# Altium project MainBoard.PrjPCB
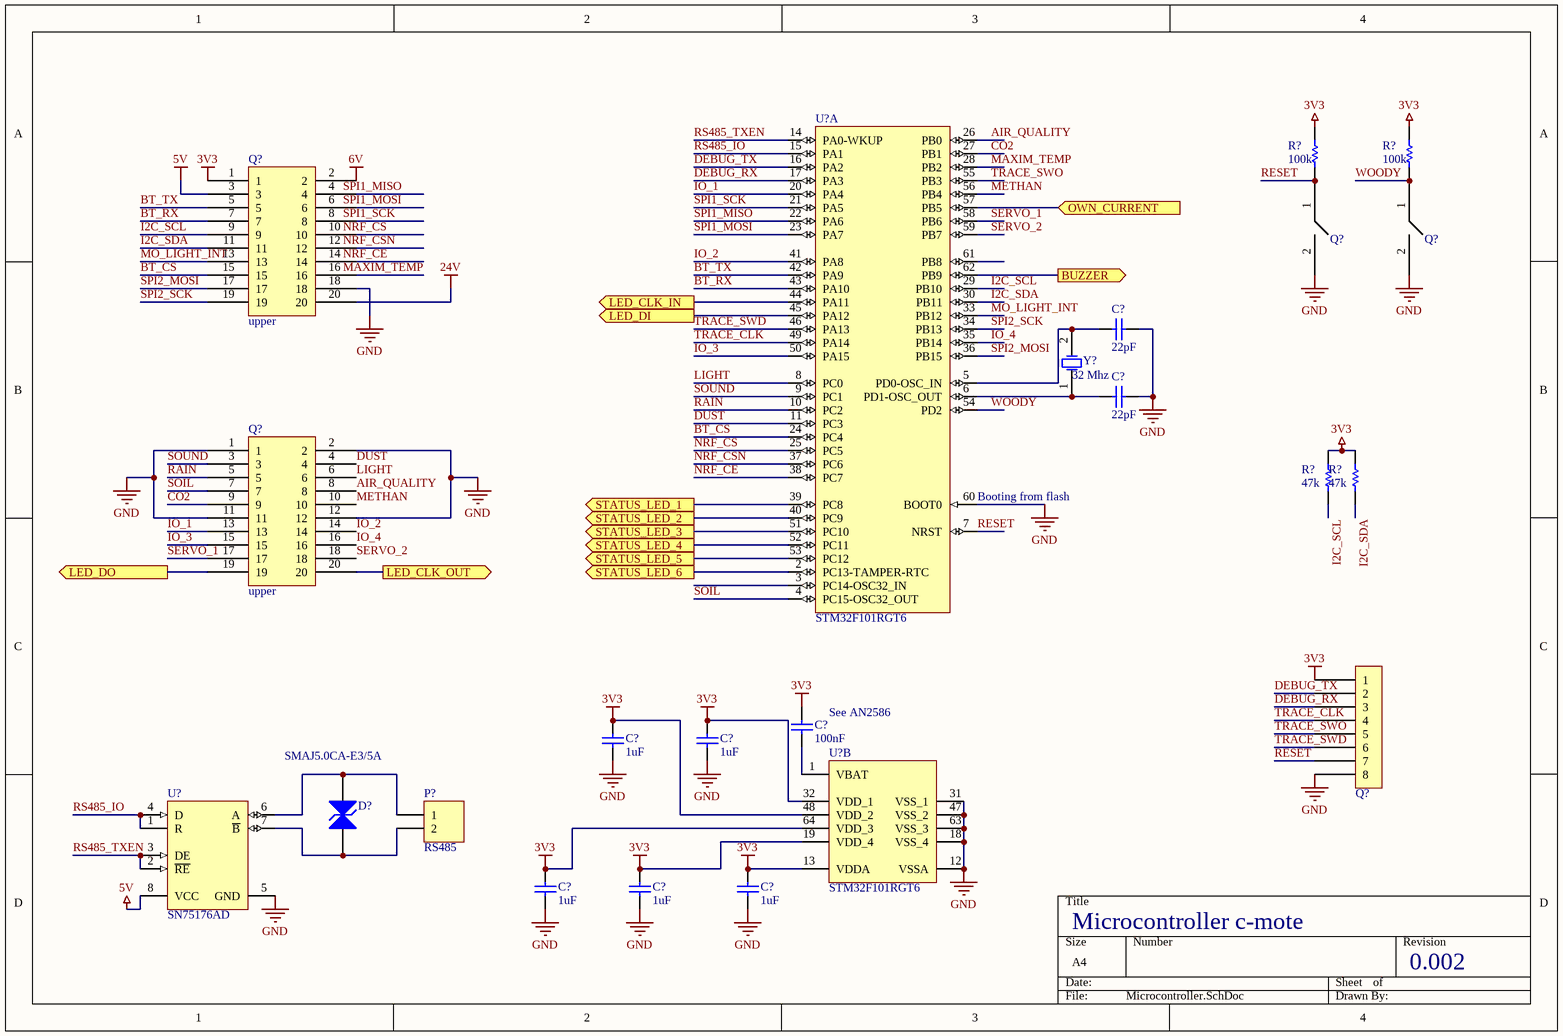
[diagram p0: Microcontroller.SchDoc]
3 sheets, 100 parts. Net scope: flat (ports and power ports of the same name join across sheets).
Sheets:
  Microcontroller.SchDoc
  Power.SchDoc
  IO.SchDoc

## Sheet Microcontroller.SchDoc
size A4

### Parts
(Parts that share a designator on the sheet are numbered #1, #2 ... from top to bottom, then left to right.)
C?#1  value 22pF  [CAPC0805(2012)100_M]  (hidden comment: CAP 22pF 10V 0805(2012))
C?#2  value 22pF  [CAPC0805(2012)100_M]  (hidden comment: CAP 22pF 10V 0805(2012))
C?#3  value 100nF  [CAPC0805(2012)100_M]  (hidden comment: CAP 22pF 10V 0805(2012))
C?#4  value 1uF  [CAPC0805(2012)100_M]  (hidden comment: CAP 22pF 10V 0805(2012))
C?#5  value 1uF  [CAPC0805(2012)100_M]  (hidden comment: CAP 22pF 10V 0805(2012))
C?#6  value 1uF  [CAPC0805(2012)100_M]  (hidden comment: CAP 22pF 10V 0805(2012))
C?#7  value 1uF  [CAPC0805(2012)100_M]  (hidden comment: CAP 22pF 10V 0805(2012))
C?#8  value 1uF  [CAPC0805(2012)100_M]  (hidden comment: CAP 22pF 10V 0805(2012))
D?#1  SMAJ5.0CA-E3/5A  [VISH-DO-214AC-2_N]
P?#1  RS485  [HDR1X2]
Q?#1  SMD Button  [SMD Button Right Angel]  (value not drawn)
Q?#2  SMD Button  [SMD Button Right Angel]  (value not drawn)
Q?#3  upper  [HEADER_2x10_SMD_1.27mm_TOP]
Q?#4  upper  [HEADER_2x10_SMD_1.27mm_TOP]
Q?#5  Program and debug interface  [Program and debug]  (value not drawn)
R?#1  100k  [RESC0805(2012)_L]
R?#2  100k  [RESC0805(2012)_L]
R?#3  47k  [RESC0805(2012)_L]
R?#4  47k  [RESC0805(2012)_L]
U?#1  STM32F101RGT6  [STM-LQFP64_V]  (part A of 2)
U?#2  STM32F101RGT6  [STM-LQFP64_V]  (part B of 2)
U?#3  SN75176AD  [D8_M]
Y?  32 Mhz  [R38]

### Ports
BUZZER (out), LED_CLK_IN (out), LED_CLK_OUT (out), LED_DI (out), LED_DO (out), OWN_CURRENT (in), STATUS_LED_1 (out), STATUS_LED_2 (out), STATUS_LED_3 (out), STATUS_LED_4 (out), STATUS_LED_5 (out), STATUS_LED_6 (out)

### Nets
3V3: C?#3.1 C?#4.2 C?#5.2 C?#6.2 C?#7.2 C?#8.2 Q?#3.1 Q?#5.1 R?#1.2 R?#2.2 R?#3.1 R?#4.1 U?#2.13(VDDA) U?#2.19(VDD_4) U?#2.32(VDD_1) U?#2.48(VDD_2) U?#2.64(VDD_3)
5V: Q?#3.3 U?#3.8(VCC)
6V: Q?#3.2
24V: Q?#3.20
GND: C?#1.1 C?#2.1 C?#4.1 C?#5.1 C?#6.1 C?#7.1 C?#8.1 Q?#1.2 Q?#2.2 Q?#3.18 Q?#4.1 Q?#4.2 Q?#4.11 Q?#4.12 Q?#5.8 U?#1.60(BOOT0) U?#2.12(VSSA) U?#2.18(VSS_4) U?#2.31(VSS_1) U?#2.47(VSS_2) U?#2.63(VSS_3) U?#3.5(GND)
AIR_QUALITY: Q?#4.8 U?#1.26(PB0)
BT_CS: Q?#3.15 U?#1.24(PC4)
BT_RX: Q?#3.7 U?#1.43(PA10)
BT_TX: Q?#3.5 U?#1.42(PA9)
CO2: Q?#4.9 U?#1.27(PB1)
DEBUG_RX: Q?#5.3 U?#1.17(PA3)
DEBUG_TX: Q?#5.2 U?#1.16(PA2)
DUST: Q?#4.4 U?#1.11(PC3)
I2C_SCL: Q?#3.9 R?#3.2 U?#1.29(PB10)
I2C_SDA: Q?#3.11 R?#4.2 U?#1.30(PB11)
IO_1: Q?#4.13 U?#1.20(PA4)
IO_2: Q?#4.14 U?#1.41(PA8)
IO_3: Q?#4.15 U?#1.50(PA15)
IO_4: Q?#4.16 U?#1.35(PB14)
LIGHT: Q?#4.6 U?#1.8(PC0)
MAXIM_TEMP: U?#1.28(PB2)
METHAN: Q?#4.10 U?#1.56(PB4)
MO_LIGHT_INT: Q?#3.13 U?#1.33(PB12)
NRF_CE: U?#1.38(PC7)
NRF_CS: U?#1.25(PC5)
NRF_CSN: U?#1.37(PC6)
RAIN: Q?#4.5 U?#1.10(PC2)
RESET: Q?#1.1 Q?#5.7 R?#1.1 U?#1.7(NRST)
RS485_IO: U?#1.15(PA1) U?#3.1(R) U?#3.4(D)
RS485_TXEN: U?#1.14(PA0-WKUP) U?#3.2(~{RE}) U?#3.3(DE)
SERVO_1: Q?#4.17 U?#1.58(PB6)
SERVO_2: Q?#4.18 U?#1.59(PB7)
SOIL: Q?#4.7 U?#1.4(PC15-OSC32_OUT)
SOUND: Q?#4.3 U?#1.9(PC1)
SPI1_MISO: U?#1.22(PA6)
SPI1_MOSI: U?#1.23(PA7)
SPI1_SCK: U?#1.21(PA5)
SPI2_MOSI: Q?#3.17 U?#1.36(PB15)
SPI2_SCK: Q?#3.19 U?#1.34(PB13)
TRACE_CLK: Q?#5.4 U?#1.49(PA14)
TRACE_SWD: Q?#5.6 U?#1.46(PA13)
TRACE_SWO: Q?#5.5 U?#1.55(PB3)
WOODY: Q?#2.1 R?#2.1 U?#1.54(PD2)
NetC?#1_2: C?#1.2 U?#1.5(PD0-OSC_IN) Y?.2(OSC2)
NetC?#2_2: C?#2.2 U?#1.6(PD1-OSC_OUT) Y?.1(OSC1)
NetC?#3_2: C?#3.2 U?#2.1(VBAT)
NetD?#1_1: D?#1.1(A1) P?#1.2 U?#3.7(~{B})
NetD?#1_2: D?#1.2(A2) P?#1.1 U?#3.6(A)
NetQ?#4_19: Q?#4.19 ; port LED_DO
NetQ?#4_20: Q?#4.20 ; port LED_CLK_OUT
NetQ?#9_11: U?#1.44(PA11) ; port LED_CLK_IN
NetQ?#9_13: U?#1.45(PA12) ; port LED_DI
NetQ?#10_1: U?#1.62(PB9) ; port BUZZER
NetR?#15_2: U?#1.57(PB5) ; port OWN_CURRENT
NetR?#18_2: U?#1.39(PC8) ; port STATUS_LED_1
NetR?#19_2: U?#1.40(PC9) ; port STATUS_LED_2
NetR?#20_2: U?#1.51(PC10) ; port STATUS_LED_3
NetR?#21_2: U?#1.52(PC11) ; port STATUS_LED_4
NetR?#25_2: U?#1.53(PC12) ; port STATUS_LED_5
NetR?#26_2: U?#1.2(PC13-TAMPER-RTC) ; port STATUS_LED_6

Not connected (* = marked no-connect by the designer): Q?#3 4 6 8 10 12 14 16; U?#1 3(PC14-OSC32_IN) 61(PB8)

### Notes on the sheet
- (near U?#1) Booting from flash
- (near C?#3) See AN2586
- Microcontroller c-mote
- 0.002
- Labels drawn without touching a wire or pin: MAXIM_TEMP, NRF_CE, NRF_CS, NRF_CSN, SPI1_MISO, SPI1_MOSI, SPI1_SCK

### Library data of the parts
C?#1-C?#8 = CMP-1036-01210-1: CAP 22pF 10V ±5% 0805 (2012 Metric) Thickness 1mm SMD; Case-EIA: 0805; Case-Metric: 2012; Max Thickness: 1 mm; Rated Voltage: 10 V; Tolerance: ±5%; Technology: SMT
D?#1 = CMP-0548-00276-2: Transient Voltage Suppressor, 6.40 to 231 V, 5 V Stand-off Voltage, Bi-Directional, -55 to 155 degC, 2-pin DO-214AC, Pb-Free, Tape and Reel; Manufacturer: Vishay Semiconductor; PPPM (W): 400, 300; VBR Bi-Directional (V): 6.4 to 231; ID (uA): 1600; IFSM: 40 A; VWM (V): 5; RoHS: TRUE; Operating Junction and Storage Temperature Range: -55 to 150 degC; Packing: Tape and Reel; ComponentLink1URL: http://www.vishay.com/; Mounting Technology: Surface Mount; ComponentLink2URL: http://www.vishay.com/docs/88390/smaj50a.pdf; PartNumber: SMAJ5.0CA-E3/5A; PackageReference: DO-214AC-2; ComponentLink1Description: Manufacturer URL; ComponentLink3Description: Package Specification; ComponentLink2Description: Datasheet; PackageDescription: 2-Pin DO-214AC (SMA), Body 4.245 x 2.665 mm; DatasheetVersion: 12/8/2013; ComponentLink3URL: http://www.vishay.com/docs/88390/smaj50a.pdf; digikey: http://www.digikey.com/product-detail/en/SMAJ5.0CA-E3%2F61/SMAJ5.0CA-E3%2F61GICT-ND/1091642
P?#1 = Header 2: Header, 2-Pin; LatestRevisionDate: 17-Jul-2002; LatestRevisionNote: Re-released for DXP Platform.; Publisher: Altium Limited
Q?#3 Q?#4 = c-moteconnector upper: c-mote upper connector
R?#1 R?#2 = CMP-1013-00122-1: 100K 0.125W 5% 0805 (2012 Metric)  SMD; Case-Metric: 2012; Case-EIA: 0805; Tolerance: 5 %; Technology: SMT; Value: 100k; Power: 0.125 W
R?#3 R?#4 = CMP-1013-00114-1: 47K 0.125W 5% 0805 (2012 Metric)  SMD; Case-Metric: 2012; Case-EIA: 0805; Tolerance: 5 %; Power: 0.125 W; Technology: SMT; Value: 47k
U?#1 U?#2 = CMP-0237-00281-2: ARM Cortex-M3 32-bit MCU, 1024 KB Flash, 80 KB Internal RAM, 51 I/Os, 64-pin LQFP, -40 to 85 degC, Tray; Internal RAM Size (kB): 80; FLASH Size (Prog) (kB): 1024; I/Os (High Current): 51; A/D Converter: 2x12-bit (16 Channels); D/A Converter: 2x12-bit (2 Channels); Supply Voltage(Vcc) min (V): 2; Operating Frequency(F) (Processor speed) (MHz): 36; ComponentLink2URL: http://www.st.com/st-web-ui/static/active/en/resource/technical/document/datasheet/CD00253739.pdf; Packing: Tray; PartNumber: STM32F101RGT6; ComponentLink3Description: Package Specification; PackageDescription: 64-Pin Low Profile Quad Flat Package, 10 x 10 mm Body, 0.5 mm Pitch; ComponentLink2Description: Datasheet; PackageReference: LQFP64; ComponentLink1URL: http://www.st.com/web/en/home.html; Core: ARM Cortex-M3; Mounting Technology: Surface Mount; PackageVersion: Rev. 4, 06/2013; ComponentLink1Description: Manufacturer URL; ComponentLink3URL: http://www.st.com/st-web-ui/static/active/en/resource/technical/document/datasheet/DM00037051.pdf; DatasheetVersion: Rev. 2
U?#3 = CMP-0310-00139-1: Differential Bus Transceiver, 1 TX / 1 RX, 5V, 0 to 70 degC, 8-Pin SOIC (D), Green (RoHS & no Sb/Br); Manufacturer: Texas Instruments; Drivers Per Package: 1; Rating: Catalog; Supply Voltage(s)(V): 5; ESD(kV): 2; ICC(Max)(mA): 50; SubFamily: RS-422; Mounting Technology: Surface Mount; Code_JEDEC: MS-012AA; PartNumber: SN75176AD; PackageVersion: revM, Jun-2011; PackageReference: D8; Eco-Plan: Green (RoHS & no Sb/Br); Receivers Per Package: 1; ComponentLink1URL: http://www.ti.com/general/docs/lit/getliterature.tsp?genericPartNumber=SN75176A&fileType=pdf; ComponentLink2Description: Package Specification; PackageDescription: 8-Pin Plastic Small Outline Integrated Circuit, 4.9 x 3.9 mm, Pitch 1.27 mm Pitch; ComponentLink2URL: http://www.ti.com/lit/ml/msoi002j/msoi002j.pdf; ComponentLink1Description: Datasheet; DatasheetVersion: SLLS100A; # of TX/RX: 1 TX / 1 RX; Isolated: No; Footprint: SN75176
Y? = XTAL: Crystal Oscillator; Published: 8-Jun-2000; LatestRevisionDate: 17-Jul-2002; LatestRevisionNote: Re-released for DXP Platform.; PackageReference: R38; Publisher: Altium Limited; PackageDescription: Crystal, Thru-Hole; 2 Leads; Body 3.1 x 8.2 mm (Dia.xH); Frequency: 32 Mhz
Q?#1 Q?#2 = SMD Button: AlieX: http://www.aliexpress.com/item/Original-new-100-100pcs-Little-turtle-button-switch-2-pin-SMD-tact-switch-with-fixed-point/1969145919.html

## Sheet Power.SchDoc
size A4
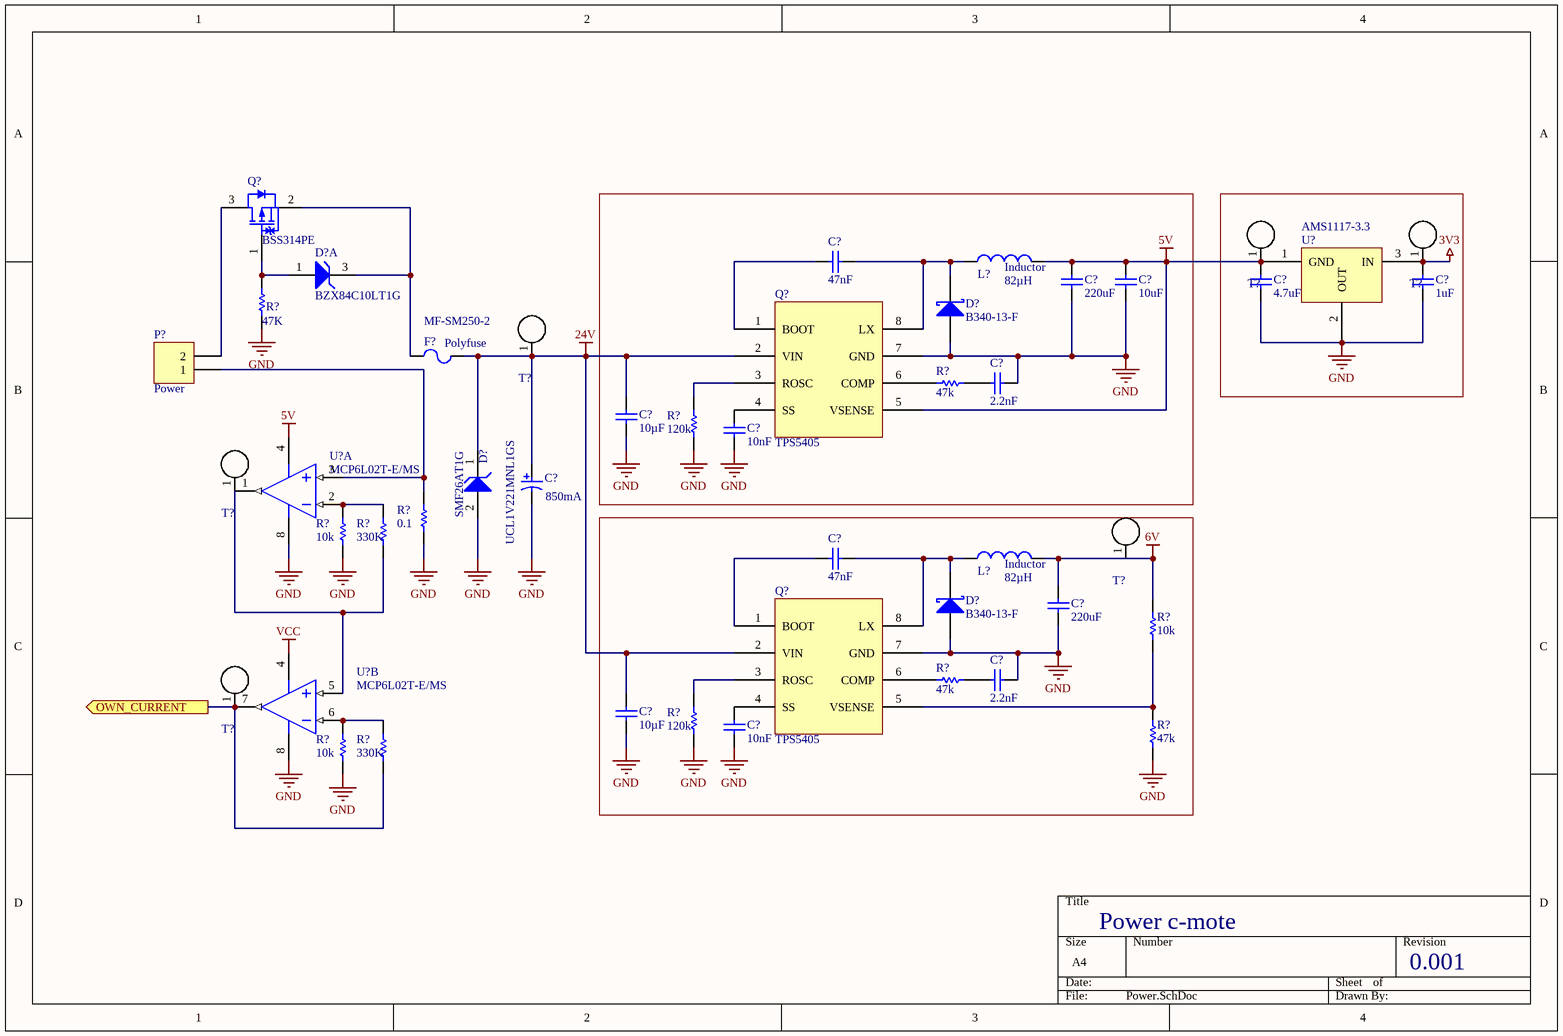
[diagram p1: Power.SchDoc]

### Parts
(Parts that share a designator on the sheet are numbered #1, #2 ... from top to bottom, then left to right.)
C?#9  value 47nF  [CAPC0805(2012)145_M]  (hidden comment: CAP 1uF 10V 0805(2012))
C?#10  value 220uF  [CAPC0805(2012)145_M]  (hidden comment: CAP 1uF 10V 0805(2012))
C?#11  value 10uF  [CAPC0805(2012)145_M]  (hidden comment: CAP 1uF 10V 0805(2012))
C?#12  value 4.7uF  [CAPC0805(2012)145_M]  (hidden comment: CAP 1uF 10V 0805(2012))
C?#13  value 1uF  [CAPC0805(2012)145_M]  (hidden comment: CAP 1uF 10V 0805(2012))
C?#14  value 2.2nF  [CAPC0805(2012)145_M]  (hidden comment: CAP 1uF 10V 0805(2012))
C?#15  value 10µF  [CAPC0805(2012)145_M]  (hidden comment: CAP 1uF 10V 0805(2012))
C?#16  value 10nF  [CAPC0805(2012)145_M]  (hidden comment: CAP 1uF 10V 0805(2012))
C?#17  UCL1V221MNL1GS  Rated Ripple Current (at 100kHz): 850mA  [NIC-CAPA2-8X10_V]
C?#18  value 47nF  [CAPC0805(2012)145_M]  (hidden comment: CAP 1uF 10V 0805(2012))
C?#19  value 220uF  [CAPC0805(2012)145_M]  (hidden comment: CAP 1uF 10V 0805(2012))
C?#20  value 2.2nF  [CAPC0805(2012)145_M]  (hidden comment: CAP 1uF 10V 0805(2012))
C?#21  value 10µF  [CAPC0805(2012)145_M]  (hidden comment: CAP 1uF 10V 0805(2012))
C?#22  value 10nF  [CAPC0805(2012)145_M]  (hidden comment: CAP 1uF 10V 0805(2012))
D?#2  BZX84C10LT1G  [ONSC-SOT-23-3-318-08_V]  (part A of 2)
D?#3  B340-13-F  [SMB]
D?#4  SMF26AT1G  [ONSC-SOD-123FL-2-498_V]
D?#5  B340-13-F  [SMB]
F?  Polyfuse  PartNumber: MF-SM250-2  [BOUR-MF-SM250_V]
L?#1  Inductor  value 82µH  [INDC3216]
L?#2  Inductor  value 82µH  [INDC3216]
P?#2  Power  [HDR1X2]
Q?#6  BSS314PE  [INF-PG-SOT23_N]
Q?#7  TPS5405  [TPS5405 - duplicate]
Q?#8  TPS5405  [TPS5405 - duplicate]
R?#5  value 47K  [RESC0805(2012)_N]  (hidden comment: 47K 1% 0805(2012))
R?#6  47k  [6-0805]
R?#7  120k  [6-0805]
R?#8  0.1  [6-0805]
R?#9  10k  [6-0805]
R?#10  330K  [6-0805]
R?#11  10k  [6-0805]
R?#12  47k  [6-0805]
R?#13  120k  [6-0805]
R?#14  10k  [6-0805]
R?#15  330K  [6-0805]
R?#16  47k  [6-0805]
T?#1  Testpoint  [Testpoint]  (value not drawn)
T?#2  Testpoint  [Testpoint]  (value not drawn)
T?#3  Testpoint  [Testpoint]  (value not drawn)
T?#4  Testpoint  [Testpoint]  (value not drawn)
T?#5  Testpoint  [Testpoint]  (value not drawn)
T?#6  Testpoint  [Testpoint]  (value not drawn)
U?#4  AMS1117-3.3  [SOT223]
U?#5  MCP6L02T-E/MS  [MSOP-MS8_M]  (part A of 2)
U?#6  MCP6L02T-E/MS  [MSOP-MS8_M]  (part B of 2)

### Ports
OWN_CURRENT (out)

### Nets
3V3: C?#13.2 U?#4.3(IN)
5V: C?#10.1 C?#11.1 C?#12.2 L?#1.2 Q?#7.5(VSENSE) U?#4.1(GND) U?#5.4(VSS)
6V: C?#19.1 L?#2.2 R?#11.2
24V: C?#15.1 C?#17.1 C?#21.1 D?#4.1(K) F?.2 Q?#7.2(VIN) Q?#8.2(VIN)
GND: C?#10.2 C?#11.2 C?#12.1 C?#13.1 C?#14.1 C?#15.2 C?#16.2 C?#17.2 C?#19.2 C?#20.1 C?#21.2 C?#22.2 D?#3.1(A) D?#4.2(A) D?#5.1(A) Q?#7.7(GND) Q?#8.7(GND) R?#5.1 R?#7.2 R?#8.2 R?#9.2 R?#13.2 R?#14.2 R?#16.1 U?#4.2(OUT) U?#5.8(VDD) U?#6.8(VDD)
VCC: U?#6.4(VSS)
NetC?#9_1: C?#9.1 D?#3.2(K) L?#1.1 Q?#7.8(LX)
NetC?#9_2: C?#9.2 Q?#7.1(BOOT)
NetC?#14_2: C?#14.2 R?#6.2
NetC?#16_1: C?#16.1 Q?#7.4(SS)
NetC?#18_1: C?#18.1 D?#5.2(K) L?#2.1 Q?#8.8(LX)
NetC?#18_2: C?#18.2 Q?#8.1(BOOT)
NetC?#20_2: C?#20.2 R?#12.2
NetC?#22_1: C?#22.1 Q?#8.4(SS)
NetD?#2_1: D?#2.1(A) Q?#6.1(GATE) R?#5.2
NetD?#2_3: D?#2.3(K) F?.1 Q?#6.2(SOURCE)
NetP?#2_1: P?#2.1 R?#8.1 U?#5.3(VINA+)
NetP?#2_2: P?#2.2 Q?#6.3(DRAIN)
NetQ?#7_3: Q?#7.3(ROSC) R?#7.1
NetQ?#7_6: Q?#7.6(COMP) R?#6.1
NetQ?#8_3: Q?#8.3(ROSC) R?#13.1
NetQ?#8_5: Q?#8.5(VSENSE) R?#11.1 R?#16.2
NetQ?#8_6: Q?#8.6(COMP) R?#12.1
NetR?#9_1: R?#9.1 R?#10.1 U?#5.2(VINA-)
NetR?#10_2: R?#10.2 U?#5.1(VOUTA) U?#6.5(VINB+)
NetR?#14_1: R?#14.1 R?#15.1 U?#6.6(VINB-)
NetR?#15_2: R?#15.2 U?#6.7(VOUTB) ; port OWN_CURRENT

Not connected (* = marked no-connect by the designer): T?#1 1; T?#2 1; T?#3 1; T?#4 1; T?#5 1; T?#6 1

### Notes on the sheet
- Power c-mote
- 0.001

### Library data of the parts
C?#9-C?#16 C?#18-C?#22 = CMP-1036-04740-1: CAP 1uF 10V ±20% 0805 (2012 Metric) Thickness 1.45mm SMD; Case-Metric: 2012; Case-EIA: 0805; Technology: SMT; Rated Voltage: 10 V; Tolerance: ±20%; Max Thickness: 1.45 mm
C?#17 = CMP-0687-00080-1: Aluminum Electrolytic Capacitor, UD Series, Low Impedance, 220 uF, 35 V, + / - 20%, -55 to 105 degC, Chip Type, 8 x 10 mm D x L, Pb-Free, Reel; Manufacturer: Nichicon; Tolerance Rated Capacitance: -20 to 20%; Rated Capacitance: 220 uF; Rated Voltage: 35 V; Packing: Dia382mm Reel; Impedance: 80mOhm; PackageDescription: 2-Pin Surface Mount Device, Diameter 8 mm, Height 10 mm, Pitch 6.5 mm; Length: 10 mm; RoHS: TRUE; PartNumber: UCL1V221MNL1GS; PackageReference: CAPAE-D8H10; Diameter: 8 mm; Mounting Technology: Surface Mount; digikey: http://www.digikey.com/product-detail/en/UCL1V221MNL1GS/493-3957-1-ND/2300384
D?#2 = CMP-1060-00877-1: Zener Voltage Regulator, 225 mW, 3-Pin SOT-23, Pb-Free, Tape and Reel; Manufacturer: On Semiconductor; ComponentLink1Description: Manufacturer URL; PartNumber: BZX84C10LT1G; ComponentLink1URL: http://www.onsemi.com/; DatasheetVersion: Rev. 17; ComponentLink2Description: Datasheet; ComponentLink3Description: Package Specification; PackageReference: SOT-23-3-318-08; ComponentLink3URL: http://www.onsemi.cn/pub_link/Collateral/318-08.PDF; Packing: Tape and Reel; RoHS: Pb-Free; PackageDescription: 3-Pin Small Outline Transistor, Body 2.92 x 1.3 mm, Pitch 0.95 mm; ComponentLink2URL: http://www.onsemi.com/pub_link/Collateral/BZX84C2V4LT1-D.PDF; Mounting Technology: Surface Mount; PackageVersion: Rev. AP, 11/2009
D?#3 D?#5 = D Schottky: Schottky Diode; Published: 8-Jun-2000; LatestRevisionDate: 17-Jul-2002; LatestRevisionNote: Re-released for DXP Platform.; PackageReference: SMB; Publisher: Altium Limited; PackageDescription: DO-214-AA/SMB; 2 C-Bend Leads; Body 5.3 x 3.6 mm, inc. leads (LxW); Code_JEDEC: DO-214-AA; Digikey: http://www.digikey.com/product-detail/en/B340-13-F/B340-FDICT-ND/768811
D?#4 = CMP-1061-00617-1: 200 W Transient Voltage Suppressor, 2-Pin SOD-123FL, Pb-Free, Tape and Reel; Manufacturer: On Semiconductor; Direction: Unidirectional; V(BR) Typ (V): 30.4; IR Max (uA): 1; ComponentLink2Description: Datasheet; PackageDescription: 2-Pin SOD, Body 1.65 x 2.7 mm; ComponentLink3Description: Package Specification; PartNumber: SMF26AT1G; ComponentLink3URL: http://www.onsemi.com/pub_link/Collateral/498-01.PDF; DatasheetVersion: Rev. 7; Mounting Technology: Surface Mount; ComponentLink1Description: Manufacturer URL; RoHS: Pb-Free; PackageReference: SOD-123FL-2-498; PackageVersion: Rev. D, 05/2013; Packing: Tape and Reel; ComponentLink2URL: http://www.onsemi.com/pub_link/Collateral/SMF5.0AT1-D.PDF; ComponentLink1URL: http://www.onsemi.com/
F? = CMP-0280-00001-1: Polyfuse, SMD 5A; Manufacturer: Bourns; Nominal Voltage: 15 V; Power Dissipation: 1.9 W; Junction Temperature: -40 to 85 degC; PackageReference: MF-SM250; Mounting Technology: Surface Mount; PackageDescription: 2-Pin SMT Fuse, 9.5 x 6.71 mm Body; ComponentLink1URL: http://www.bourns.com/; ComponentLink2Description: Datasheet; DatasheetVersion: Rev. P, 11/2010; ComponentLink1Description: Manufacturer URL; ComponentLink2URL: http://www.bourns.com/data/global/pdfs/mfsm.pdf; digikey: http://www.digikey.com/product-detail/en/MF-SM250-2/MF-SM250CT-ND/265590
L?#1 L?#2 = Inductor: Code_IEC: 1005; Published: 8-Jun-2000; LatestRevisionDate: 29-May-2009; LatestRevisionNote: IPC-7351 Footprint Added.; PackageReference: 0402-A; Publisher: Altium Limited; PackageDescription: Chip Inductor; Code_JEITA: 0402; DigiKey: http://www.digikey.com/product-detail/en/SDE1006A-820K/SDE1006A-820KCT-ND/4927194
P?#2 = Header 2: Header, 2-Pin; LatestRevisionDate: 17-Jul-2002; LatestRevisionNote: Re-released for DXP Platform.; Publisher: Altium Limited
Q?#6 = CMP-1099-00027-1: P-Channel OptiMOS P3 Small-Signal-Transistor, -30 V VDS, -1.5 A ID, -55 to 150 degC, PG-SOT23, Reel, Green; Manufacturer: Infineon; Rth: 250 K/W; RDS (on) (max): 140 mOhm; QG: -2.9 nC; IDpuls (max): -6.1 A; RDS (on) (max) (@4.5V): 230 mOhm; Pto t (max): 0.5 W; Green: TRUE; VDS (max): -30 V; VGS(th) (max): -2 V; VGS(th) (min): -1 V; ID (max): -1.5 A; ComponentLink2URL: http://www.infineon.com/dgdl/BSS314PE_rev2.3.pdf?folderId=db3a304314dca38901154a72e3951a65&fileId=db3a304330f68606013109b696aa0084; ComponentLink3Description: Package Specification; ComponentLink1URL: http://www.infineon.com/; ComponentLink1Description: Manufacturer URL; Mounting Technology: Surface Mount; PartNumber: BSS314PE; PackageReference: PG-SOT23; PackageVersion: Apr-08; Halogen-free: TRUE; ComponentLink3URL: http://www.infineon.com/dgdl/SOT23-Package_Overview.pdf?folderId=db3a30431936bc4b0119532290053c66&fileId=db3a30431936bc4b0119533468123c85; PackageDescription: 3-Pin Small Outline Transistor Package, 2.9 x 1.3 mm Body, 0.95 mm Pitch; ComponentLink2Description: Datasheet; DatasheetVersion: Rev. 2.3; Packing: Reel
Q?#7 Q?#8 = TPS5405: Step Down Regulator
  Q?#7: Digikey: http://www.digikey.com/product-detail/en/TPS5405DR/296-30579-2-ND/3478075; PDF: http://www.ti.com/lit/ds/symlink/tps5405.pdf
R?#5 = CMP-1013-00699-1: 47K 0.125W 1% 0805 (2012 Metric)  SMD; Case-Metric: 2012; Case-EIA: 0805; Power: 0.125 W; Tolerance: 1 %; Technology: SMT
R?#6-R?#16 = ERJ6RB: Precision Thick Film Chip Resistor, 10 Ohm to 1M Ohm Range, 1% and 0.5% Tolerance, 0805 Size, 0.1 W; Published: 17-Dec-2003; LatestRevisionDate: 19-Mar-2004; LatestRevisionNote: Silkscreen size reduced.; PackageDocument: Mar-2003; PackageReference: 6-0805; Publisher: Altium Limited; Code_IPC: 2012 [0805]; ComponentLink1Description: Manufacturer Link; ComponentLink1URL: http://www.panasonic.com/industrial/components/resistive_products.htm; ComponentLink2Description: Datasheet; ComponentLink2URL: http://www.panasonic.com/industrial/components/pdf/AOA0000CE2.pdf
U?#4 = AMS1117
U?#5 U?#6 = CMP-0187-00499-2: 1 MHz, 85 μA Dual Op Amp, 8-Pin MSOP, Extended Temperature Range, Tape and Reel; ComponentLink2URL: http://ww1.microchip.com/downloads/en/DeviceDoc/22140b.pdf; PackageDescription: 8-Lead Plastic Micro Small Outline Package (MS) [MSOP]; ComponentLink1URL: http://www.microchip.com/; ComponentLink1Description: Manufacturer URL; RevisionNote: URLs added. DatasheetVersion updated.; PackageVersion: revBB, Aug-2009; ComponentLink3URL: http://www.microchip.com/stellent/groups/techpub_sg/documents/packagingspec/en012702.pdf; ComponentLink2Description: Datasheet; ComponentLink3Description: Package Specification; DatasheetVersion: revB, Sep-2011; PackageReference: MSOP-MS8

## Sheet IO.SchDoc
size A4
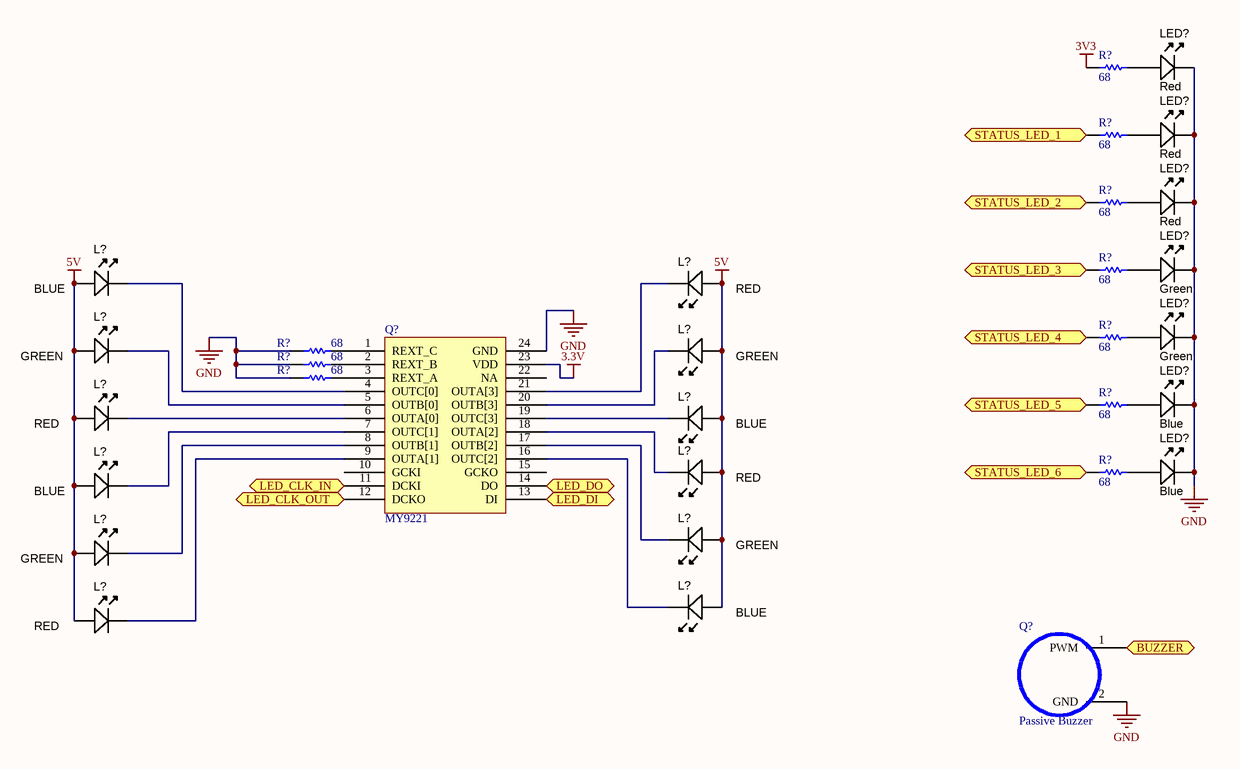
[diagram p2: IO.SchDoc]

### Parts
(Parts that share a designator on the sheet are numbered #1, #2 ... from top to bottom, then left to right.)
L?#3  Color: BLUE  [LED-0805-K]
L?#4  Color: RED  [LED-0805-K]
L?#5  Color: GREEN  [LED-0805-K]
L?#6  Color: GREEN  [LED-0805-K]
L?#7  Color: RED  [LED-0805-K]
L?#8  Color: BLUE  [LED-0805-K]
L?#9  Color: BLUE  [LED-0805-K]
L?#10  Color: BLUE  [LED-0805-K]
L?#11  Color: GREEN  [LED-0805-K]
L?#12  Color: GREEN  [LED-0805-K]
L?#13  Color: RED  [LED-0805-K]
L?#14  Color: RED  [LED-0805-K]
LED?#1  Color: Red  [LED-0805-K]
LED?#2  Color: Red  [LED-0805-K]
LED?#3  Color: Red  [LED-0805-K]
LED?#4  Color: Green  [LED-0805-K]
LED?#5  Color: Green  [LED-0805-K]
LED?#6  Color: Blue  [LED-0805-K]
LED?#7  Color: Blue  [LED-0805-K]
Q?#9  MY9221
Q?#10  Passive Buzzer  [Passive Buzzer]
R?#17  68  [6-0805]
R?#18  68  [6-0805]
R?#19  68  [6-0805]
R?#20  68  [6-0805]
R?#21  68  [6-0805]
R?#22  68  [6-0805]
R?#23  68  [6-0805]
R?#24  68  [6-0805]
R?#25  68  [6-0805]
R?#26  68  [6-0805]

### Ports
BUZZER (in), LED_CLK_IN (in), LED_CLK_OUT (out), LED_DI (in), LED_DO (out), STATUS_LED_1 (in), STATUS_LED_2 (in), STATUS_LED_3 (in), STATUS_LED_4 (in), STATUS_LED_5 (in), STATUS_LED_6 (in)

### Nets
3.3V: Q?#9.23(VDD)
3V3: R?#17.2
5V: L?#3.A L?#4.A L?#5.A L?#6.A L?#7.A L?#8.A L?#9.A L?#10.A L?#11.A L?#12.A L?#13.A L?#14.A
GND: LED?#1.K LED?#2.K LED?#3.K LED?#4.K LED?#5.K LED?#6.K LED?#7.K Q?#9.24(GND) Q?#10.2(GND) R?#22.2 R?#23.2 R?#24.2
NetL?#3_K: L?#3.K Q?#9.4(OUTC[0])
NetL?#4_K: L?#4.K Q?#9.21(OUTA[3])
NetL?#5_K: L?#5.K Q?#9.5(OUTB[0])
NetL?#6_K: L?#6.K Q?#9.20(OUTB[3])
NetL?#7_K: L?#7.K Q?#9.6(OUTA[0])
NetL?#8_K: L?#8.K Q?#9.19(OUTC[3])
NetL?#9_K: L?#9.K Q?#9.18(OUTA[2])
NetL?#10_K: L?#10.K Q?#9.7(OUTC[1])
NetL?#11_K: L?#11.K Q?#9.17(OUTB[2])
NetL?#12_K: L?#12.K Q?#9.8(OUTB[1])
NetL?#13_K: L?#13.K Q?#9.16(OUTC[2])
NetL?#14_K: L?#14.K Q?#9.9(OUTA[1])
NetLED?#1_A: LED?#1.A R?#17.1
NetLED?#2_A: LED?#2.A R?#18.1
NetLED?#3_A: LED?#3.A R?#19.1
NetLED?#4_A: LED?#4.A R?#20.1
NetLED?#5_A: LED?#5.A R?#21.1
NetLED?#6_A: LED?#6.A R?#25.1
NetLED?#7_A: LED?#7.A R?#26.1
NetQ?#4_19: Q?#9.14(DO) ; port LED_DO
NetQ?#4_20: Q?#9.12(DCKO) ; port LED_CLK_OUT
NetQ?#9_1: Q?#9.1(REXT_C) R?#22.1
NetQ?#9_2: Q?#9.2(REXT_B) R?#23.1
NetQ?#9_3: Q?#9.3(REXT_A) R?#24.1
NetQ?#9_11: Q?#9.11(DCKI) ; port LED_CLK_IN
NetQ?#9_13: Q?#9.13(DI) ; port LED_DI
NetQ?#10_1: Q?#10.1(PWM) ; port BUZZER
NetR?#18_2: R?#18.2 ; port STATUS_LED_1
NetR?#19_2: R?#19.2 ; port STATUS_LED_2
NetR?#20_2: R?#20.2 ; port STATUS_LED_3
NetR?#21_2: R?#21.2 ; port STATUS_LED_4
NetR?#25_2: R?#25.2 ; port STATUS_LED_5
NetR?#26_2: R?#26.2 ; port STATUS_LED_6

Not connected (* = marked no-connect by the designer): Q?#9 10(GCKI) 15(GCKO) 22(NA)

### Library data of the parts
L?#3 L?#8-L?#10 = LED_SMD_Green_0805_6mcd: LED, 0805 SMD, Green; Manufacturer 1: LITE-ON; Manufacturer Part Number 1: LTST-C171GKT; Material: GaP; Ratings: 6 mcd; 569 nm; Value: BLUE; SCDType: source; Package / Case: 0805; Supplier 1: Digi-Key; Supplier Part Number 1: 160-1423-1-ND
L?#4 L?#7 L?#13 L?#14 = LED_SMD_Green_0805_6mcd: LED, 0805 SMD, Green; Manufacturer 1: LITE-ON; Manufacturer Part Number 1: LTST-C171GKT; Material: GaP; Ratings: 6 mcd; 569 nm; Value: RED; SCDType: source; Package / Case: 0805; Supplier 1: Digi-Key; Supplier Part Number 1: 160-1423-1-ND
L?#5 L?#6 L?#11 L?#12 LED?#4 LED?#5 = LED_SMD_Green_0805_6mcd: LED, 0805 SMD, Green; Manufacturer 1: LITE-ON; Manufacturer Part Number 1: LTST-C171GKT; Material: GaP; Ratings: 6 mcd; 569 nm; SCDType: source; Package / Case: 0805; Supplier 1: Digi-Key; Supplier Part Number 1: 160-1423-1-ND
  L?#5 L?#6 L?#11 L?#12: Value: GREEN
  LED?#4 LED?#5: Value: Green
LED?#1 = LED_SMD_Red_0805_6mcd: LED 0805 SMD Red 6mcd 621nm; Manufacturer 1: Lite-On Inc; Manufacturer Part Number 1: LTST-C171EKT; Material: GaAsP on GaP; Ratings: 6 mcd; 621 nm; SCDType: source; Package / Case: 0805; Supplier 1: Digi-Key; Supplier Part Number 1: 160-1422-1-ND; Value: Red
LED?#2 LED?#3 = LED_SMD_Green_0805_6mcd: LED, 0805 SMD, Green; Manufacturer 1: LITE-ON; Manufacturer Part Number 1: LTST-C171GKT; Material: GaP; Ratings: 6 mcd; 569 nm; Value: Red; SCDType: source; Package / Case: 0805; Supplier 1: Digi-Key; Supplier Part Number 1: 160-1423-1-ND
LED?#6 LED?#7 = LED_SMD_Green_0805_6mcd: LED, 0805 SMD, Green; Manufacturer 1: LITE-ON; Manufacturer Part Number 1: LTST-C171GKT; Material: GaP; Ratings: 6 mcd; 569 nm; Value: Blue; SCDType: source; Package / Case: 0805; Supplier 1: Digi-Key; Supplier Part Number 1: 160-1423-1-ND
Q?#9 = MY9221: Adaptive Pulse Density Modulation Control; PDF: http://www.seeedstudio.com/wiki/images/9/98/MY9221_DS_1.0.pdf
R?#17-R?#26 = ERJ6RB: as R?#6 on sheet Power; Published: 17-Dec-2003; LatestRevisionDate: 19-Mar-2004; LatestRevisionNote: Silkscreen size reduced.; PackageDocument: Mar-2003; PackageReference: 6-0805; Publisher: Altium Limited; Code_IPC: 2012 [0805]; ComponentLink1Description: Manufacturer Link; ComponentLink1URL: http://www.panasonic.com/industrial/components/resistive_products.htm; ComponentLink2Description: Datasheet; ComponentLink2URL: http://www.panasonic.com/industrial/components/pdf/AOA0000CE2.pdf
Q?#10 = Passive Buzzer: ALIX: http://www.aliexpress.com/item/General-passive-buzzer-magnetic-type-impedance-16-2khz-3v-5v-12v-general/1952004434.html

## Nets that join several sheets
3V3: Microcontroller (17 pins), Power (C?#13.2 U?#4.3), IO (R?#17.2)
5V: Microcontroller (Q?#3.3 U?#3.8), Power (7 pins), IO (12 pins)
6V: Microcontroller (Q?#3.2), Power (C?#19.1 L?#2.2 R?#11.2)
24V: Microcontroller (Q?#3.20), Power (7 pins)
GND: Microcontroller (22 pins), Power (27 pins), IO (12 pins)
NetQ?#4_19: Microcontroller (Q?#4.19), IO (Q?#9.14)
NetQ?#4_20: Microcontroller (Q?#4.20), IO (Q?#9.12)
NetQ?#9_11: Microcontroller (U?#1.44), IO (Q?#9.11)
NetQ?#9_13: Microcontroller (U?#1.45), IO (Q?#9.13)
NetQ?#10_1: Microcontroller (U?#1.62), IO (Q?#10.1)
NetR?#15_2: Microcontroller (U?#1.57), Power (R?#15.2 U?#6.7)
NetR?#18_2: Microcontroller (U?#1.39), IO (R?#18.2)
NetR?#19_2: Microcontroller (U?#1.40), IO (R?#19.2)
NetR?#20_2: Microcontroller (U?#1.51), IO (R?#20.2)
NetR?#21_2: Microcontroller (U?#1.52), IO (R?#21.2)
NetR?#25_2: Microcontroller (U?#1.53), IO (R?#25.2)
NetR?#26_2: Microcontroller (U?#1.2), IO (R?#26.2)